# EAGLE design dac (EAGLE 8.3.2)

## Sheet 1 of 7: Power Supply
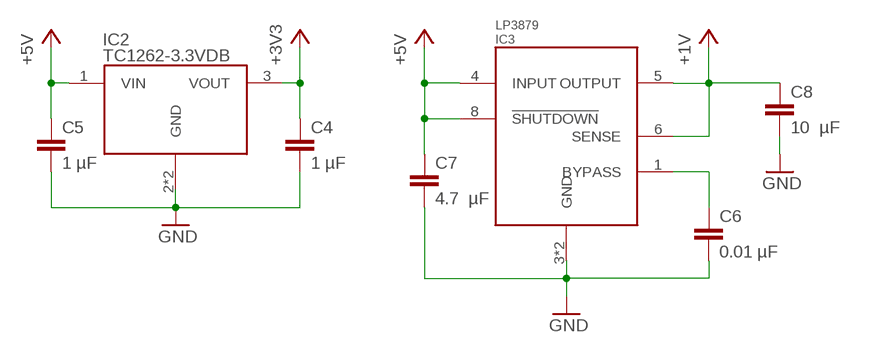
[diagram p0: schematic, sheet 1]

### Parts
C4  1 µF  C-EUC0402  [C0402]
C5  1 µF  C-EUC0402  [C0402]
C6  0.01 µF  C-EUC0402  [C0402]
C7  4.7 µF  C-EUC0402  [C0402]
C8  10 µF  C-EUC0402  [C0402]
IC2  TC1262-3.3VDB  [SOT223]
IC3  LP3879  [SO08]

### Nets
+1V: C8.1 IC3.5(OUTPUT) IC3.6(SENSE) ; also sheet 3,7
+3V3: C4.1 IC2.3(VOUT) ; also sheet 3,4,7
+5V: C5.1 C7.1 IC2.1(VIN) IC3.4(INPUT) IC3.8(!SHUTDOWN) ; also sheet 2,3,4,5,6
GND: C4.2 C5.2 C6.2 C7.2 C8.2 IC2.2(GND) IC2.4(GND) IC3.3(GND) IC3.P$1(GND) ; also sheet 2,3,4,5,6,7
N$2: C6.1 IC3.1(BYPASS)

## Sheet 2 of 7: USB Connection + RESET
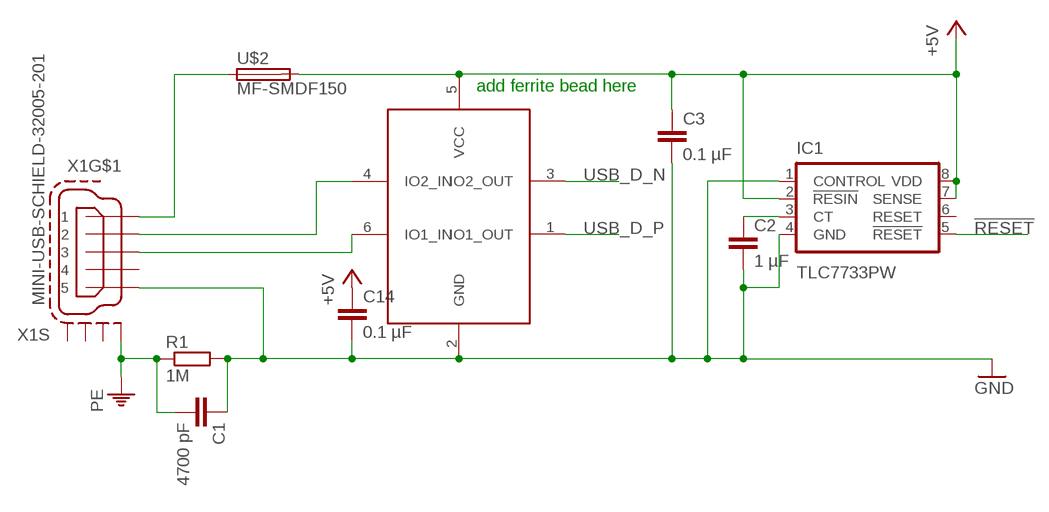
[diagram p1: schematic, sheet 2]

### Parts
C1  4700 pF  C-EUC0402  [C0402]
C2  1 µF  C-EUC0402  [C0402]
C3  0.1 µF  C-EUC0402  [C0402]
C14  0.1 µF  C-EUC0402  [C0402]
IC1  TLC7733PW  [PW_R-PDSO-G08]
IC5  RCLAMP0502ASMD  [SOT666]
R1  1M  R-EU_R0402  [R0402]
U$2  MF-SMDF150  [MF-SMDF050]
X1  MINI-USB-SCHIELD-32005-201  [32005-201]

### Nets
!RESET: IC1.5(!RESET) ; also sheet 3,4,7
+5V: C3.1 C14.1 IC1.2(!RESIN) IC1.7(SENSE) IC1.8(VDD) IC5.5(VCC) U$2.2 ; also sheet 1,3,4,5,6
GND: C1.1 C2.2 C3.2 C14.2 IC1.1(CONTROL) IC1.4(GND) IC5.2(GND) R1.2 X1.5 ; also sheet 1,3,4,5,6,7
N$1: U$2.1 X1.1
N$3: IC5.4(IO2_IN) X1.2
N$4: IC5.6(IO1_IN) X1.3
N$5: C2.1 IC1.3(CT)
PE: C1.2 R1.1 X1.M1(S:S1)
USB_D_N: IC5.3(IO2_OUT) ; also sheet 3
USB_D_P: IC5.1(IO1_OUT) ; also sheet 3
Unconnected: IC1.6(RESET) X1.4 X1.M2(S:S2) X1.M3(S:S3) X1.M4(S:S4)

### Notes on the sheet
- add ferrite bead here

## Sheet 3 of 7: USB to I2S
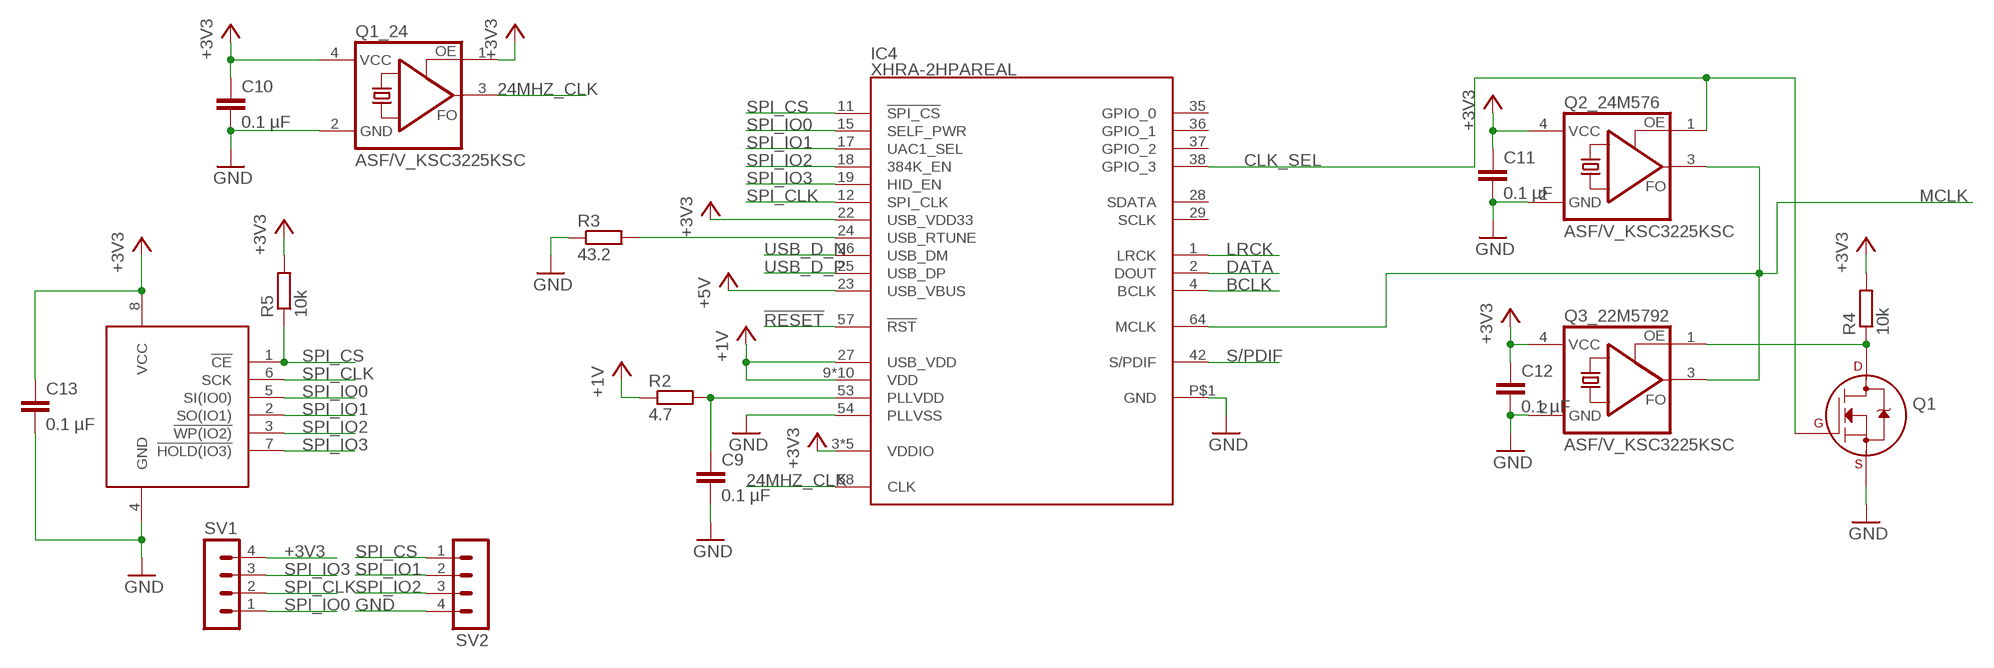
[diagram p2: schematic, sheet 3]

### Parts
C9  0.1 µF  C-EUC0402  [C0402]
C10  0.1 µF  C-EUC0402  [C0402]
C11  0.1 µF  C-EUC0402  [C0402]
C12  0.1 µF  C-EUC0402  [C0402]
C13  0.1 µF  C-EUC0402  [C0402]
IC4  XHRA-2HPAREAL  [TQFP64-10X10]
Q1  2N7002_SOT23  [SOT-23]
Q1_24  ASF/V_KSC3225KSC  [KSC]
Q2_24M576  ASF/V_KSC3225KSC  [KSC]
Q3_22M5792  ASF/V_KSC3225KSC  [KSC]
R2  4.7  R-EU_R0402  [R0402]
R3  43.2  R-EU_R0402  [R0402]
R4  10k  R-EU_R0402  [R0402]
R5  10k  R-EU_R0402  [R0402]
SV1  MA04-1  [MA04-1]
SV2  MA04-1  [MA04-1]
U$1  S25FL116K  [SO8]

### Nets
24MHZ_CLK: IC4.58(CLK) Q1_24.3(FO)
!RESET: IC4.57(!RST) ; also sheet 2,4,7
+1V: IC4.9(VDD) IC4.10(VDD) IC4.20(VDD) IC4.27(USB_VDD) IC4.31(VDD) IC4.39(VDD) IC4.40(VDD) IC4.41(VDD) IC4.52(VDD) IC4.56(VDD) IC4.59(VDD) R2.1 ; also sheet 1,7
+3V3: C10.1 C11.1 C12.1 C13.1 IC4.3(VDDIO) IC4.13(VDDIO) IC4.22(USB_VDD33) IC4.34(VDDIO) IC4.44(VDDIO) IC4.55(VDDIO) Q1_24.1(OE) Q1_24.4(VCC) Q2_24M576.4(VCC) Q3_22M5792.4(VCC) R4.2 R5.2 SV1.4 U$1.8(VCC) ; also sheet 1,4,7
+5V: IC4.23(USB_VBUS) ; also sheet 1,2,4,5,6
BCLK: IC4.4(BCLK) ; also sheet 4
CLK_SEL: IC4.38(GPIO_3) Q1.1(G) Q2_24M576.1(OE)
DATA: IC4.2(DOUT) ; also sheet 4
GND: C9.2 C10.2 C11.2 C12.2 C13.2 IC4.54(PLLVSS) IC4.P$1(GND) Q1.2(S) Q1_24.2(GND) Q2_24M576.2(GND) Q3_22M5792.2(GND) R3.1 SV2.4 U$1.4(GND) ; also sheet 1,2,4,5,6,7
LRCK: IC4.1(LRCK) ; also sheet 4
MCLK: IC4.64(MCLK) Q2_24M576.3(FO) Q3_22M5792.3(FO) ; also sheet 4
N$6: C9.1 IC4.53(PLLVDD) R2.2
N$7: IC4.24(USB_RTUNE) R3.2
N$9: Q1.3(D) Q3_22M5792.1(OE) R4.1
S/PDIF: IC4.42(S/PDIF)
SPI_CLK: IC4.12(SPI_CLK) SV1.2 U$1.6(SCK)
SPI_CS: IC4.11(!SPI_CS) R5.1 SV2.1 U$1.1(!CE)
SPI_IO0: IC4.15(SELF_PWR) SV1.1 U$1.5(SI(IO0))
SPI_IO1: IC4.17(UAC1_SEL) SV2.2 U$1.2(SO(IO1))
SPI_IO2: IC4.18(384K_EN) SV2.3 U$1.3(!WP(IO2))
SPI_IO3: IC4.19(HID_EN) SV1.3 U$1.7(!HOLD(IO3))
USB_D_N: IC4.26(USB_DM) ; also sheet 2
USB_D_P: IC4.25(USB_DP) ; also sheet 2
Unconnected: IC4.28(SDATA) IC4.29(SCLK) IC4.35(GPIO_0) IC4.36(GPIO_1) IC4.37(GPIO_2)

## Sheet 4 of 7: DAC
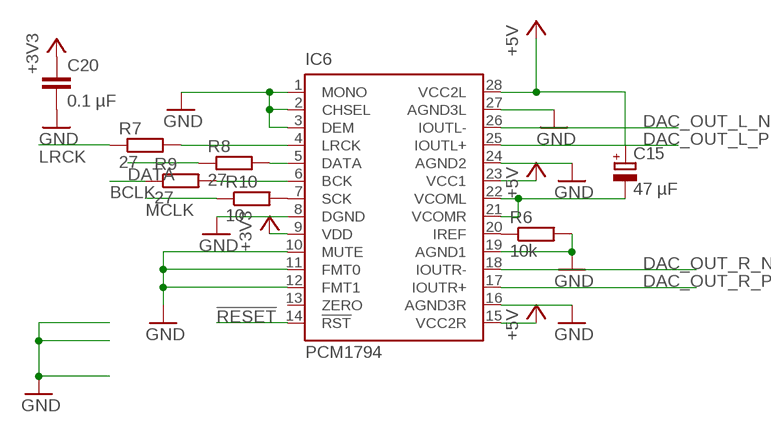
[diagram p3: schematic, sheet 4]

### Parts
C15  47 µF  CPOL-EU140CLH-0810  [140CLH-0810]
C20  0.1 µF  C-EUC0402  [C0402]
IC6  PCM1794  [DB_R-PDSO-G28]
R6  10k  R-EU_R0603  [R0603]
R7  27  R-EU_R0603  [R0603]
R8  27  R-EU_R0603  [R0603]
R9  27  R-EU_R0603  [R0603]
R10  10  R-EU_R0603  [R0603]

### Nets
!RESET: IC6.14(!RST) ; also sheet 2,3,7
+3V3: C20.1 IC6.9(VDD) ; also sheet 1,3,7
+5V: C15.+ IC6.15(VCC2R) IC6.23(VCC1) IC6.28(VCC2L) ; also sheet 1,2,3,5,6
BCLK: R9.1 ; also sheet 3
DAC_OUT_L_N: IC6.26(IOUTL-) ; also sheet 5
DAC_OUT_L_P: IC6.25(IOUTL+) ; also sheet 5
DAC_OUT_R_N: IC6.18(IOUTR-) ; also sheet 5
DAC_OUT_R_P: IC6.17(IOUTR+) ; also sheet 5
GND: C20.2 IC6.1(MONO) IC6.2(CHSEL) IC6.3(DEM) IC6.8(DGND) IC6.10(MUTE) IC6.11(FMT0) IC6.12(FMT1) IC6.16(AGND3R) IC6.19(AGND1) IC6.24(AGND2) IC6.27(AGND3L) R6.2 ; also sheet 1,2,3,5,6,7
N$8: C15.- IC6.21(VCOMR) IC6.22(VCOML)
N$10: IC6.4(LRCK) R7.2
N$15: IC6.20(IREF) R6.1
N$16: IC6.5(DATA) R8.2
N$17: IC6.6(BCK) R9.2
N$18: IC6.7(SCK) R10.2
Unconnected: IC6.13(ZERO) R7.1 R8.1 R10.1

## Sheet 5 of 7: I/V
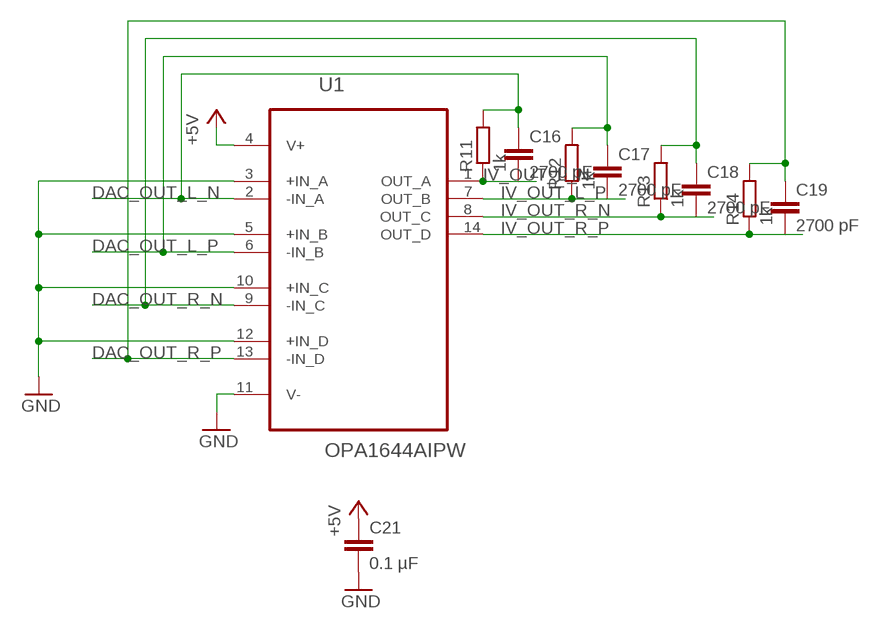
[diagram p4: schematic, sheet 5]

### Parts
C16  2700 pF  C-EUC0603  [C0603]
C17  2700 pF  C-EUC0603  [C0603]
C18  2700 pF  C-EUC0603  [C0603]
C19  2700 pF  C-EUC0603  [C0603]
C21  0.1 µF  C-EUC0603  [C0603]
R11  1k  R-EU_R0603  [R0603]
R12  1k  R-EU_R0603  [R0603]
R13  1k  R-EU_R0603  [R0603]
R14  1k  R-EU_R0603  [R0603]
U1  OPA1644AIPW  [SOP65P640X120-14N]

### Nets
+5V: C21.1 U1.4(V+) ; also sheet 1,2,3,4,6
DAC_OUT_L_N: C16.1 R11.2 U1.2(-IN_A) ; also sheet 4
DAC_OUT_L_P: C17.1 R12.2 U1.6(-IN_B) ; also sheet 4
DAC_OUT_R_N: C18.1 R13.2 U1.9(-IN_C) ; also sheet 4
DAC_OUT_R_P: C19.1 R14.2 U1.13(-IN_D) ; also sheet 4
GND: C21.2 U1.3(+IN_A) U1.5(+IN_B) U1.10(+IN_C) U1.11(V-) U1.12(+IN_D) ; also sheet 1,2,3,4,6,7
IV_OUT_L_N: C16.2 R11.1 U1.1(OUT_A) ; also sheet 6
IV_OUT_L_P: C17.2 R12.1 U1.7(OUT_B) ; also sheet 6
IV_OUT_R_N: C18.2 R13.1 U1.8(OUT_C) ; also sheet 6
IV_OUT_R_P: C19.2 R14.1 U1.14(OUT_D) ; also sheet 6

## Sheet 6 of 7: Output
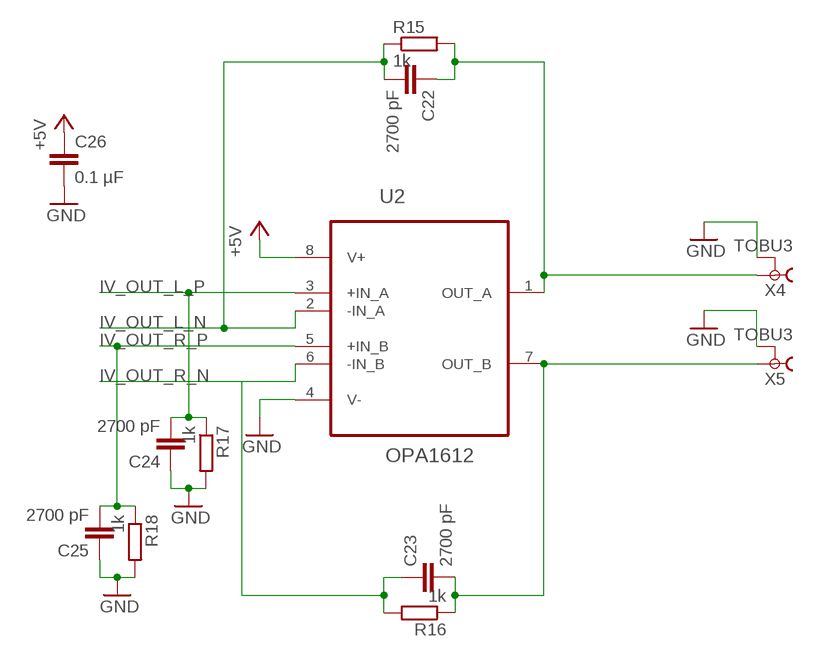
[diagram p5: schematic, sheet 6]

### Parts
C22  2700 pF  C-EUC0603  [C0603]
C23  2700 pF  C-EUC0603  [C0603]
C24  2700 pF  C-EUC0603  [C0603]
C25  2700 pF  C-EUC0603  [C0603]
C26  0.1 µF  C-EUC0603  [C0603]
R15  1k  R-EU_R0603  [R0603]
R16  1k  R-EU_R0603  [R0603]
R17  1k  R-EU_R0603  [R0603]
R18  1k  R-EU_R0603  [R0603]
U2  OPA1612  [SO8]
X4  TOBU3  [TOBU3]
X5  TOBU3  [TOBU3]

### Nets
+5V: C26.1 U2.8(V+) ; also sheet 1,2,3,4,5
GND: C24.1 C25.1 C26.2 R17.2 R18.2 U2.4(V-) X4.2 X4.2@1 X4.2@2 X5.2 X5.2@1 X5.2@2 ; also sheet 1,2,3,4,5,7
IV_OUT_L_N: C22.2 R15.1 U2.2(-IN_A) ; also sheet 5
IV_OUT_L_P: C24.2 R17.1 U2.3(+IN_A) ; also sheet 5
IV_OUT_R_N: C23.1 R16.2 U2.6(-IN_B) ; also sheet 5
IV_OUT_R_P: C25.2 R18.1 U2.5(+IN_B) ; also sheet 5
N$13: C22.1 R15.2 U2.1(OUT_A) X4.1
N$14: C23.2 R16.1 U2.7(OUT_B) X5.1

## Sheet 7 of 7: Reset
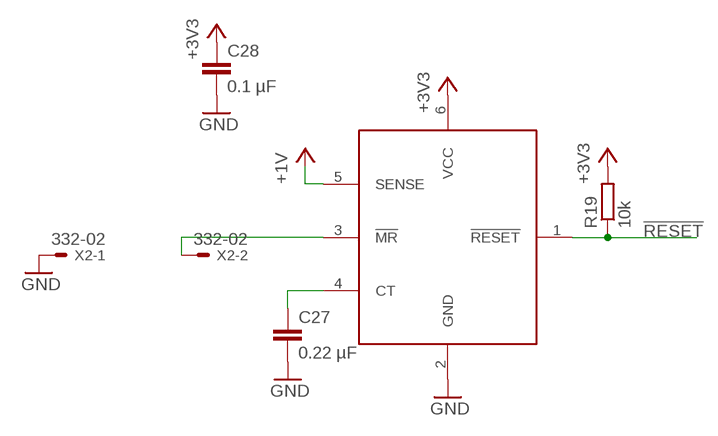
[diagram p6: schematic, sheet 7]

### Parts
C27  0.22 µF  C-EUC0603  [C0603]
C28  0.1 µF  C-EUC0603  [C0603]
R19  10k  R-EU_R0603  [R0603]
U$4  TPS3808  [SOT23-6]
X2  332-02  [332-02]

### Nets
!RESET: R19.1 U$4.1(!RESET) ; also sheet 2,3,4
+1V: U$4.5(SENSE) ; also sheet 1,3
+3V3: C28.1 R19.2 U$4.6(VCC) ; also sheet 1,3,4
GND: C27.2 C28.2 U$4.2(GND) X2.1 ; also sheet 1,2,3,4,5,6
N$11: C27.1 U$4.4(CT)
N$12: U$4.3(!MR) X2.2

## Library data of the parts
C1 = rcl:C-EU: CAPACITOR, European symbol; MF: AVX; MPN: 08055C472KAT2A; OC_FARNELL: 499213
C2 C4-C8 = rcl:C-EU: CAPACITOR, European symbol; MF: MULTICOMP; MPN: MC0805B104K500A5.08MM; OC_FARNELL: 2395773
C3 C10-C14 C20 = rcl:C-EU: CAPACITOR, European symbol; MF: WALSIN; MPN: 0402N101J500CT; OC_FARNELL: 2496792
C9 C16-C19 C21-C26 = rcl:C-EU: CAPACITOR, European symbol
C15 = rcl:CPOL-EU: POLARIZED CAPACITOR, European symbol
C27 C28 = resistor:C-EU: CAPACITOR, European symbol
IC1 = texas:TLC77*: MICROPOWER SUPPLY VOLTAGE SUPERVISORS Source: www.ti.com/.. slvs087l.pdf; MPN: TLC7733QPWG4; OC_FARNELL: unknown; OC_NEWARK: 54K1054
IC2 = jean:TC1262-3.3VDB
IC3 = jean:LP3879
IC4 = jean:XHRA-2HPA
IC5 = jean:RCLAMP0502A; OC_FARNELL: unknown
IC6 = jean:PCM1794: 24-BIT, 192-kHz SAMPLING, ADVANCED SEGMENT, AUDIO STEREO DIGITAL-TO-ANALOG CONVERTER Source: http://focus.ti.com/lit/ds/symlink/pcm1792.pdf; MF: TEXAS INSTRUMENTS; MPN: PCM1792DB; OC_FARNELL: 1207081; OC_NEWARK: 61H5171
Q1 = transistors:2N700*: 2N7000, 2N7002, NDS7002A N-channel enhancement mode MOSFET
Q1_24 Q2_24M576 Q3_22M5792 = jean:ASF/V*_KSC3225: CRYSTAL CLOCK OSCILLATORS 5.0 Vdc or 3.3 Vdc - LOW PROFILE ULTRA MINIATURE CERAMIC SURFACE MOUNT Source: http://www.abracon.com/Oscillators/asf1-L-L1.pdf
R1 = rcl:R-EU_: RESISTOR, European symbol; MF: VISHAY; MPN: CRCW20101M00FKEF; OC_FARNELL: 1470038
R2-R5 R19 = resistor:R-EU_: RESISTOR, European symbol
R6-R18 = rcl:R-EU_: RESISTOR, European symbol
SV1 SV2 = con-lstb:MA04-1: PIN HEADER; OC_FARNELL: unknown; OC_NEWARK: unknown
U1 = OPA1644:OPA1644AIPW: AUDIO OPERATIONAL AMPLIFIERS; MPN: OPA1644AIPW; OC_FARNELL: 1882283; OC_NEWARK: 27T6636; PACKAGE: TSSOP-14; SUPPLIER: Texas Instruments
U2 = OPA1644:OPA1612: AUDIO OPERATIONAL AMPLIFIERS
U$1 = jean:S25FL116K
U$2 = fuse:MF-SMDF: MF-SMDF Series - PRC Resettable Fuses Source: http://www.farnell.com/datasheets/716597.pdf; MF: BOURNS; MPN: MF-SMDF150-2; OC_FARNELL: 2336867
U$4 = jean:TPS3808
X1 = con-cypressindustries:MINI-USB-SCHIELD-: MINI USB-B Conector Source: www.cypressindustries.com; OC_FARNELL: unknown; OC_NEWARK: unknown
X2 = con-garry:332-02: 2 Pin - 2mm Dual Row Source: www.mpe-connector.de / garry_shortform_2012.pdf
X4 X5 = jean:TOBU3: Female Cinch CONNECTOR ( RCA Jack ); MF: FARNELL; MPN: TOBU 3; OC_FARNELL: 592791; OC_NEWARK: 06WX5914

## Board
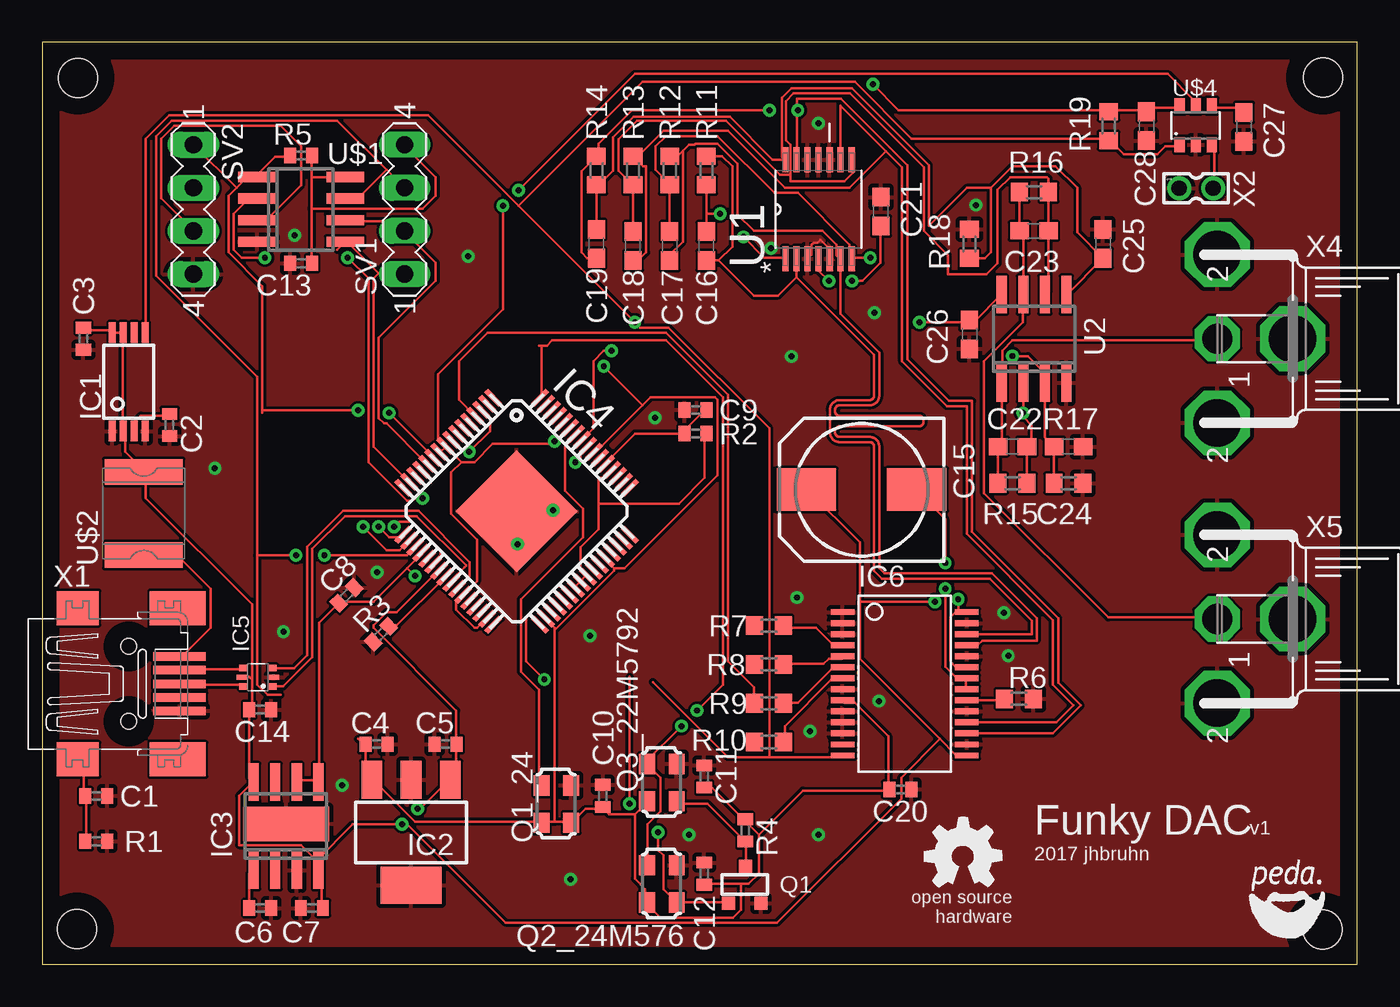
[diagram p7: board, top side]
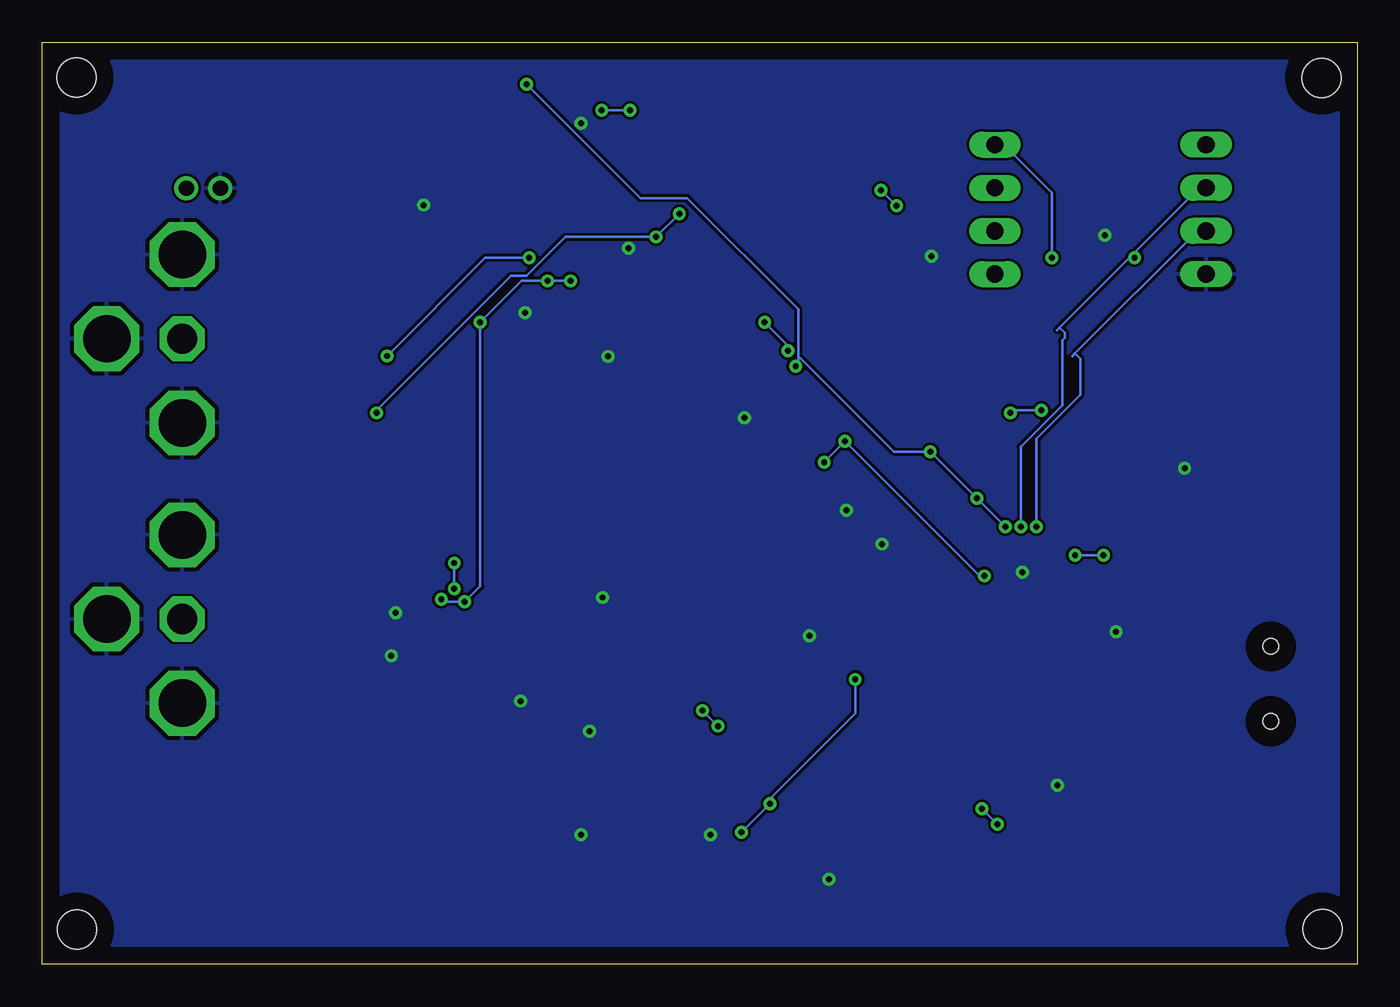
[diagram p8: board, bottom side, seen from below]

Size 77.45 x 54.28 mm. Coordinates in mm from the lower left corner, seen from the top.
Outline: 0,0 77.45,0 77.45,54.28 0,54.28 0,0
Copper layers (1*16): Top 0.035mm / dielectric 1.5mm / Bottom 0.035mm
Design rules "default": minimum track width 6mil, minimum drill 0.35mm, track to track 6mil, track to pad 6mil, pad to pad 6mil, via to via 6mil, smd to smd 6mil, copper to edge 40mil, drill to drill 6mil, minimum pad ring 10mil, minimum via ring 8mil, stop-mask expansion 4mil, vias tented up to drill 0mil, thermal gap 10mil
Holes 2.29 mm at 75.44,52.22 2.08,52.2 2.03,2.06 75.41,2.03

### Footprints (pad centres in the part's own frame; a part is rotated, then mirrored left to right if it is on the bottom)
C0402 = smd 0.7 x 0.9: 1 -0.65,0; 2 0.65,0
140CLH-0810 = smd 3.5 x 2.5: + 3.25,0; - -3.25,0
C0603 = smd 1.1 x 1: 1 -0.85,0; 2 0.85,0
PW_R-PDSO-G08 = smd 0.4 x 1.2: 1 -0.975,-2.9; 2 -0.325,-2.9; 3 0.325,-2.9; 4 0.975,-2.9; 5 0.975,2.9; 6 0.325,2.9; 7 -0.325,2.9; 8 -0.975,2.9
SOT223 = smd 1.219 x 2.235: 1 -2.311,-3.099; 2 0,-3.099; 3 2.311,-3.099 | smd 3.6 x 2.2: 4 0,3.099
SO08 = smd 0.6 x 2.2: 1 -1.905,-2.6; 2 -0.635,-2.6; 3 0.635,-2.6; 4 1.905,-2.6; 5 1.905,2.6; 6 0.635,2.6; 7 -0.635,2.6; 8 -1.905,2.6 | smd 5.08 x 2.032: P$1 0,0.127
TQFP64-10X10 = smd 1.2 x 0.3: 1 -5.7,3.75; 2 -5.7,3.25; 3 -5.7,2.75; 4 -5.7,2.25; 5 -5.7,1.75; 6 -5.7,1.25; 7 -5.7,0.75; 8 -5.7,0.25; 9 -5.7,-0.25; 10 -5.7,-0.75; 11 -5.7,-1.25; 12 -5.7,-1.75; 13 -5.7,-2.25; 14 -5.7,-2.75; 15 -5.7,-3.25; 16 -5.7,-3.75; 33 5.7,-3.75; 34 5.7,-3.25; 35 5.7,-2.75; 36 5.7,-2.25; 37 5.7,-1.75; 38 5.7,-1.25; 39 5.7,-0.75; 40 5.7,-0.25; 41 5.7,0.25; 42 5.7,0.75; 43 5.7,1.25; 44 5.7,1.75; 45 5.7,2.25; 46 5.7,2.75; 47 5.7,3.25; 48 5.7,3.75 | smd 0.3 x 1.2: 17 -3.75,-5.7; 18 -3.25,-5.7; 19 -2.75,-5.7; 20 -2.25,-5.7; 21 -1.75,-5.7; 22 -1.25,-5.7; 23 -0.75,-5.7; 24 -0.25,-5.7; 25 0.25,-5.7; 26 0.75,-5.7; 27 1.25,-5.7; 28 1.75,-5.7; 29 2.25,-5.7; 30 2.75,-5.7; 31 3.25,-5.7; 32 3.75,-5.7; 49 3.75,5.7; 50 3.25,5.7; 51 2.75,5.7; 52 2.25,5.7; 53 1.75,5.7; 54 1.25,5.7; 55 0.75,5.7; 56 0.25,5.7; 57 -0.25,5.7; 58 -0.75,5.7; 59 -1.25,5.7; 60 -1.75,5.7; 61 -2.25,5.7; 62 -2.75,5.7; 63 -3.25,5.7; 64 -3.75,5.7 | smd 5.08 x 5.08: P$1 0,0
SOT666 = smd 0.375 x 0.5: 1 -0.537,-0.85; 3 0.538,-0.85; 4 0.538,0.85; 6 -0.538,0.85 | smd 0.3 x 0.65: 2 0,-0.925; 5 0,0.925
DB_R-PDSO-G28 = smd 0.348 x 1.397: 1 -4.225,-3.656; 2 -3.575,-3.656; 3 -2.925,-3.656; 4 -2.275,-3.656; 5 -1.625,-3.656; 6 -0.975,-3.656; 7 -0.325,-3.656; 8 0.325,-3.656; 9 0.975,-3.656; 10 1.625,-3.656; 11 2.275,-3.656; 12 2.925,-3.656; 13 3.575,-3.656; 14 4.225,-3.656; 15 4.225,3.656; 16 3.575,3.656; 17 2.925,3.656; 18 2.275,3.656; 19 1.625,3.656; 20 0.975,3.656; 21 0.325,3.656; 22 -0.325,3.656; 23 -0.975,3.656; 24 -1.625,3.656; 25 -2.275,3.656; 26 -2.925,3.656; 27 -3.575,3.656; 28 -4.225,3.656
SOT-23 = smd 0.762 x 0.762: 1 -0.979,-1.101; 2 0.94,-1.101; 3 0.025,1.067
KSC = smd 1.194 x 0.94: 1 -2.088,0.476; 2 0.107,0.476; 3 0.107,2.217; 4 -2.088,2.217
R0402 = smd 0.7 x 0.9: 1 -0.65,0; 2 0.65,0
R0603 = smd 1 x 1.1: 1 -0.85,0; 2 0.85,0
MA04-1 = drill 1.016 long: 1 -3.81,0; 2 -1.27,0; 3 1.27,0; 4 3.81,0
SOP65P640X120-14N = smd 1.473 x 0.356: 1 -2.921,1.956; 2 -2.921,1.295; 3 -2.921,0.66; 4 -2.921,0; 5 -2.921,-0.66; 6 -2.921,-1.295; 7 -2.921,-1.956; 8 2.921,-1.956; 9 2.921,-1.295; 10 2.921,-0.66; 11 2.921,0; 12 2.921,0.66; 13 2.921,1.295; 14 2.921,1.956
SO8 = smd 0.6 x 2.2: 1 -1.905,-2.6; 2 -0.635,-2.6; 3 0.635,-2.6; 4 1.905,-2.6; 5 1.905,2.6; 6 0.635,2.6; 7 -0.635,2.6; 8 -1.905,2.6
MF-SMDF050 = smd 1.5 x 4.6: 1 -2.45,0; 2 2.45,0
SOT23-6 = smd 0.6 x 0.9: 1 -0.95,-1.15; 2 0,-1.15; 3 0.95,-1.15; 4 0.95,1.15; 5 0,1.15; 6 -0.95,1.15
32005-201 = smd 3.1 x 0.5: 1 3,1.6; 2 3,0.8; 3 3,0; 4 3,-0.8; 5 3,-1.6 | smd 2.5 x 2: M1 -3,-4.45; M2 -3,4.45 | smd 3.3 x 2: M3 2.9,4.45; M4 2.9,-4.45 | hole 0.9: 0,2.2; 0,-2.2
332-02 = drill 0.9 pad 1.27: 1 0,-1; 2 0,1
TOBU3 = drill 1.778 octagon: 1 0,0.635 | drill 2.794 octagon: 2 4.953,0.635; 2@1 -4.953,0.635; 2@2 0,5.08

### Placement (x,y rotation side)
C1  3.17,9.91 180 top
C2  7.49,31.75 270 top
C3  2.41,36.83 270 top
C4  19.68,12.95 0 top
C5  23.75,12.95 180 top
C6  12.83,3.3 0 top
C7  15.88,3.3 180 top
C8  17.91,21.72 45 top
C9  38.48,32.64 180 top
C10  33.02,9.91 90 top
C11  38.99,11.05 90 top
C12  38.99,5.33 90 top
C13  15.24,41.27 180 top
C14  12.83,14.99 0 top
C15  48.26,27.94 180 top
C16  39.12,42.29 90 top
C17  36.96,42.29 90 top
C18  34.8,42.29 90 top
C19  32.64,42.42 90 top
C20  50.55,10.29 0 top
C21  49.4,44.32 90 top
C22  57.15,30.48 0 top
C23  58.42,43.18 180 top
C24  60.45,30.48 180 top
C25  62.48,42.42 270 top
C26  54.61,37.08 270 top
C27  70.79,49.3 270 top
C28  65.05,49.35 270 top
IC1  5.08,34.29 0 top
IC2  21.72,7.75 180 top
IC3  14.35,8.13 0 top
IC4  27.94,26.67 315 top
IC5  12.7,16.89 90 top
IC6  50.8,16.51 270 top
Q1  41.4,4.7 0 top
Q1_24  31.62,10.41 90 top
Q2_24M576  37.85,5.71 90 top
Q3_22M5792  37.85,11.68 90 top
R1  3.17,7.24 0 top
R2  38.48,31.24 180 top
R3  19.94,19.43 45 top
R4  41.4,7.87 90 top
R5  15.24,47.62 0 top
R6  57.53,15.62 0 top
R7  42.8,19.94 0 top
R8  42.8,17.65 0 top
R9  42.8,15.37 0 top
R10  42.8,13.08 0 top
R11  39.12,46.74 90 top
R12  36.96,46.74 90 top
R13  34.8,46.74 90 top
R14  32.64,46.74 90 top
R15  57.15,28.32 180 top
R16  58.42,45.47 0 top
R17  60.45,28.32 0 top
R18  54.61,42.42 90 top
R19  62.81,49.35 90 top
SV1  21.34,44.45 90 top
SV2  8.89,44.45 270 top
U1  45.72,44.45 90 top
U2  58.42,36.83 0 top
U$1  15.24,44.45 270 top
U$2  5.97,26.54 90 top
U$3  [OSHW_5MM]  54.23,6.35 0 top
U$4  67.94,49.4 0 top
X1  5.08,16.51 0 top
X2  67.97,45.69 270 top
X4  68.58,36.83 270 top
X5  68.58,20.32 270 top

### Tracks (layer width: path | path; a pad name or v marks a point on that pad's centre or on a via)
24MHZ_CLK
  Top 0.152: Q1_24.3 29.26,10.67 29.26,16.15 28.19,17.22 28.19,21.49 31.85,25.15 31.85,26.82 30.79,27.89 30.79,30.48 31.39,31.09 IC4.58
!RESET  (via drill 0.35)
  Top 0.152: 35.97,16.61 40.39,12.19 42.82,12.19 | 42.82,12.19 47.09,12.19 IC6.14 | 28.04,44.65 v34.9,37.8 35.2,37.49 36.88,37.49 42.82,31.55 42.82,12.19 | 28.04,44.65 22.71,49.99 7.47,49.99 6.1,48.62 6.1,37.34 IC1.5 | U$4.1 66.9,48.16 66.14,48.16 65.68,47.7 63.7,47.7 62.94,48.46 R19.1 62.79,48.62 51.21,48.62 47.85,51.97 35.36,51.97 28.04,44.65 | v33.53,36.12 33.07,36.12 32.46,35.51 32.46,31.55 31.85,30.94 IC4.57
  Bottom 0.152: v33.53,36.12 33.53,36.42 v34.9,37.8
+1V  (via drill 0.35)
  Top 0.152: IC3.6 15.09,10.82 16.15,10.82 IC3.5 16.31,10.82 16.31,20.12 C8.1 17.53,21.34 19.51,21.34 21.49,23.32 | R2.1 39.01,31.24 39.01,28.65 37.49,27.13 32.77,27.13 | v28.04,45.57 34.9,52.43 66.29,52.43 67.82,50.9 67.82,50.6 U$4.5 | v27.13,44.65 27.13,38.56 23.32,34.75 23.32,30.94 23.62,30.63 IC4.9 23.77,30.48 | 21.49,23.32 22.25,24.08 IC4.20 | 31.7,22.55 31.39,22.25 IC4.39 | 31.7,22.55 32,22.86 | 31.7,22.55 IC4.40 | 31.7,29.72 31.7,30.18 32,30.48 IC4.56 | 32.77,28.65 31.7,29.72 | 32.77,28.65 33.07,28.65 33.53,29.11 IC4.52 | 32,22.86 31.7,23.16 31.7,24.54 32.77,25.6 32.77,27.13 | 32.77,28.65 32.77,27.13 | 32,22.86 IC4.41 | IC4.31 26.06,20.27 25.6,19.81 25.45,19.81 24.38,20.88 24.38,21.34 24.69,21.64 IC4.27 24.84,21.79 25.6,22.55 25.6,24.99 24.08,26.52 24.08,28.96 24.69,29.57 | 23.77,30.48 23.47,30.18 IC4.10 | 24.69,29.57 25.45,29.57 26.52,30.63 30.02,30.63 v30.18,30.79 30.94,31.55 IC4.59 | 23.77,30.48 24.69,29.57 | 31.7,29.72 31.55,29.72 v31.39,29.57 | v21.95,22.86 21.49,23.32
  Bottom 0.152: v27.13,44.65 v28.04,45.57 | v31.39,29.57 v30.18,30.79 22.25,22.86 v21.95,22.86
+3V3  (via drill 0.35)
  Top 0.152: 15.85,46.33 15.85,47.55 R5.2 | 15.85,46.33 15.85,44.5 | 15.85,44.5 15.85,41.3 C13.1 | 15.85,46.33 17.83,46.33 U$1.8 | 15.85,44.5 22.4,44.5 23.16,45.26 23.16,46.33 21.34,48.16 SV1.4 | 18.59,13.26 18.9,12.95 C4.1 19.05,11.28 19.36,10.97 IC2.3 19.51,10.82 21.95,8.38 29.26,8.38 Q1_24.4 29.41,8.38 30.18,8.38 | IC6.9 47.24,15.39 47.85,15.39 49.84,13.41 49.84,10.36 C20.1 49.84,10.21 44.81,10.21 42.22,7.62 | 41.15,4.72 41.6,4.72 42.22,5.33 42.22,7.62 | 41.15,4.72 39.01,4.72 C12.1 | 42.22,7.62 41.45,8.38 R4.2 41.3,8.53 39.47,10.36 39.01,10.36 C11.1 | 34.9,8.84 34.9,5.03 35.51,4.42 35.51,3.66 Q2_24M576.4 35.66,3.5 36.42,2.74 40.69,2.74 41.15,3.2 41.15,4.72 | 34.9,8.84 35.51,9.45 Q3_22M5792.4 | 30.18,8.38 31.09,8.38 Q1_24.1 31.24,8.38 32,9.14 32.92,9.14 C10.1 33.07,9.14 33.38,8.84 34.9,8.84 | 30.18,8.38 30.18,19.66 | U$4.6 66.9,50.44 65.23,50.44 65.08,50.29 C28.1 64.92,50.29 62.94,50.29 R19.2 62.79,50.29 50.44,50.29 v48.92,51.82 | v20.73,25.76 21.03,26.06 21.79,26.06 23.47,24.38 23.47,23.93 23.16,23.62 IC4.22 | IC4.13 22.4,29.11 22.86,28.65 22.86,28.35 22.4,27.89 v22.4,27.43 21.95,27.43 21.79,27.28 21.49,27.28 19.2,29.57 19.2,40.39 v17.98,41.6 | v25.15,30.18 26.36,31.39 26.36,32.16 25.91,32.61 IC4.3 | 35.36,32.92 35.81,33.38 39.62,33.38 39.78,33.22 39.78,28.8 34.29,23.32 33.68,23.32 | 35.36,32.92 32.61,30.18 IC4.55 | 30.18,19.66 30.18,19.81 29.72,20.27 IC4.34 | 33.68,23.32 33.22,23.77 IC4.44 | 33.68,23.32 33.68,23.16 30.18,19.66 | v33.07,35.2 35.36,32.92
  Bottom 0.152: SV1.4 21.34,48.16 20.73,48.16 17.98,45.41 v17.98,41.6 17.98,41.3 | v48.92,51.82 42.22,45.11 39.47,45.11 32.92,38.56 32.92,35.81 | 32.92,35.81 32.92,35.2 v33.07,35.2 | v20.73,25.76 v22.4,27.43 v25.15,30.18 27.28,30.18 32.92,35.81
+5V  (via drill 0.35)
  Top 0.152: U2.8 56.39,39.32 55.02,37.95 54.71,37.95 C26.1 54.56,37.8 v51.66,37.8 | v47.7,40.23 48.31,40.23 49.38,41.3 49.38,43.43 C21.1 | v46.33,40.23 45.72,40.84 U1.4 | 53.95,20.73 54.41,20.73 IC6.28 53.95,20.73 | 53.95,20.73 53.8,20.73 53.49,20.42 53.49,17.83 53.8,17.53 54.41,17.53 IC6.23 | 52.88,13.26 48.16,17.98 48.16,21.34 | 52.88,13.26 53.8,12.34 54.41,12.34 IC6.15 | 48.16,21.34 48.16,24.84 45.11,27.89 C15.+ | v53.95,21.49 53.95,20.73 | 48.16,21.34 v52.58,21.34 | C3.1 2.44,37.34 3.96,37.34 IC1.8 4.72,37.19 | 4.72,37.19 4.72,31.39 IC1.2 4.88,31.24 4.88,30.18 5.94,29.11 U$2.2 6.1,28.96 6.1,27.43 12.34,21.18 12.34,16.76 | 4.72,37.19 IC1.7 | 24.38,12.95 24.38,11.28 24.08,10.97 IC2.1 23.93,10.82 22.25,9.14 v22.1,9.14 | 24.38,12.95 24.38,14.94 19.51,19.81 19.51,19.96 20.27,20.73 20.88,20.73 23.32,23.16 IC4.23 | 24.38,12.95 C5.1 | C7.1 16.46,3.35 16.46,5.33 16.31,5.49 IC3.4 | 12.34,16.76 12.19,16.92 11.89,16.92 IC5.5 | 12.34,16.76 12.34,15.24 12.19,15.09 C14.1 12.19,14.94 12.19,10.97 12.34,10.82 IC3.8 12.34,10.67 11.58,9.91 11.58,7.01 15.24,7.01 16.15,6.1 | 16.15,6.1 16.15,5.64 IC3.4 | 16.15,6.1 18.29,8.23 v21.18,8.23 21.49,8.23 27.28,2.44 43.28,2.44 50.6,9.75 50.6,10.97 52.88,13.26 | 16.15,6.1 IC3.4
  Bottom 0.152: v46.33,40.23 v47.7,40.23 49.23,40.23 v51.66,37.8 51.66,22.25 v52.58,21.34 53.8,21.34 v53.95,21.49 | v21.18,8.23 v22.1,9.14
BCLK
  Top 0.152: R9.1 41.91,15.39 41.91,16.31 40.39,17.83 40.39,33.53 36.73,37.19 26.21,37.19 24.54,35.51 24.54,33.22 25.45,32.31 IC4.4
CLK_SEL  (via drill 0.35)
  Top 0.152: Q1.1 40.39,3.66 37.49,3.66 Q2_24M576.1 37.34,3.66 36.58,4.42 36.58,6.4 36.27,6.71 v36.27,7.77 | v34.59,9.45 34.59,16.92 | v29.57,16.76 28.5,17.83 28.5,20.42 30.33,22.25 30.48,22.25 30.94,21.79 IC4.38
  Bottom 0.152: v36.27,7.77 v34.59,9.45 34.59,9.75 29.57,14.78 v29.57,16.76
DAC_OUT_L_N
  Top 0.152: 44.42,40.45 U1.2 | 44.42,40.45 49,35.88 49,33.48 arc-90 48.73,33.22 46.96,33.22 arc90 46.39,32.65 46.39,31.32 arc90 46.96,30.75 48.73,30.75 arc-90 49,30.48 49,23.18 49.47,22.71 55.82,22.71 58.29,20.23 58.29,19.43 IC6.26 | 39.84,41.44 C16.1 | 44.42,40.45 43.34,39.37 41.91,39.37 39.84,41.44 | R11.2 40.04,47.59 40.64,46.99 40.64,42.24 39.84,41.44
DAC_OUT_L_P
  Top 0.152: IC6.25 55.12,18.8 55.37,19.05 58.57,19.05 58.57,20.38 55.94,23.01 49.59,23.01 49.3,23.3 49.3,30.48 arc90 48.73,31.05 46.96,31.05 arc-90 46.7,31.32 46.7,31.41 arc-90 46.96,31.67 51.64,31.67 arc90 51.91,31.94 51.91,32.02 arc90 51.64,32.29 46.96,32.29 arc-90 46.7,32.56 46.7,32.65 arc-90 46.96,32.91 48.73,32.91 arc90 49.3,33.48 49.3,36 47.02,38.29 U1.6 46.79,41.76 46.79,42.36 45.97,43.18 41.91,43.18 40.95,44.15 40.95,47.13 39.76,48.31 38.47,48.31 38.42,48.26 38.1,48.26 37.74,47.9 | C17.1 36.96,41.77 37.74,42.55 37.74,47.9 | R12.2 37.43,47.59 37.74,47.9
DAC_OUT_R_N
  Top 0.152: IC6.18 59.74,14.23 60.74,15.24 59.54,16.45 59.54,20.26 54.46,25.34 54.46,32.87 53.28,32.87 50.65,35.5 50.65,46.93 49.7,47.87 | 49.7,47.87 47.02,50.56 | U1.9 47.02,50.56 | 47.02,50.56 47.01,50.56 | C18.1 35.09,41.44 35.56,41.91 35.56,46.99 35.39,46.99 R13.2 34.9,47.7 35.2,47.7 36.58,49.07 40.39,49.07 43.74,45.72 47.55,45.72 49.7,47.87
DAC_OUT_R_P  (via drill 0.35)
  Top 0.152: IC6.17 59.52,13.59 61.18,15.24 59.84,16.57 59.84,20.38 54.76,25.46 54.76,33.17 53.4,33.17 50.95,35.62 50.95,47.05 47.05,50.95 44.45,50.95 44.45,50.29 | 44.45,50.29 44.45,47.4 U1.13 | C19.1 32.09,41.57 31.75,41.91 31.75,46.7 R14.2 32.77,47.7 32.77,48.31 34.75,50.29 v42.82,50.29 | v44.5,50.29 44.45,50.29
  Bottom 0.152: v44.5,50.29 v42.82,50.29
GND  (via drill 0.35)
  Top 0.152: R18.2 54.56,43.28 54.53,43.34 | U1.5 46.38,42.14 45.85,42.67 45.67,42.49 45.45,42.49 45.31,42.36 45.31,41.78 U1.3 | v27.99,24.74 27.94,24.79 IC4.P$1
  other vias: 45.72,49.53 49.02,38.35 54.99,44.7 42.93,42.16 56.64,20.7 56.9,18.16 45.21,13.72 44.45,21.59 49.28,15.49 38.1,7.62 45.72,7.62 17.65,10.54 14.86,42.93 10.16,29.21 25.07,41.68 44.12,35.79 31.11,5 30.07,26.72 36.09,32.18 19.71,23.09 14.2,19.58 32.26,19.33
  pour Top: 0,0 77.7,-0.28 77.7,54.33 0,54.61
  pour Bottom: 0,54.61 0,0 77.52,-0.3 77.52,54.31
IV_OUT_L_N  (via drill 0.35)
  Top 0.152: C16.2 39.12,44.2 | 39.12,44.2 39.12,45.47 39.37,45.72 39.28,45.72 R11.1 | R15.1 C22.2 58.42,30.48 58.27,30.63 58.27,31.75 57.78,32.23 57.78,32.46 | U2.2 57.78,32.46 | v41.3,42.82 42.52,41.6 43.74,41.6 U1.1 | 39.12,44.2 v39.93,44.2 | v57.76,32.46 57.78,32.46
  Bottom 0.152: v39.93,44.2 v41.3,42.82 46.63,42.82 48.92,40.54 49.84,40.54 57.76,32.61 v57.76,32.46
IV_OUT_L_P  (via drill 0.35)
  Top 0.152: C17.2 36.92,43.18 36.83,43.18 36.96,43.31 R12.1 36.88,46.02 36.12,46.79 36.12,48.16 36.73,48.77 39.78,48.77 43.13,45.41 44.5,45.41 47.55,42.37 47.55,41.6 U1.7 47.7,41.6 v48.77,41.6 | U2.3 59.05,32.23 | U2.3 59.05,31.03 C24.2 R17.1 | v57.15,35.81 58.06,35.81 58.98,34.9 58.98,34.29 U2.3
  Bottom 0.152: v57.15,35.81 51.36,41.6 v48.77,41.6
IV_OUT_R_N
  Top 0.152: U2.6 59.27,39.65 C23.1 59.27,45.3 59.69,45.72 59.52,45.72 R16.2 59.27,46.27 59.18,46.35 57.02,46.35 56.26,45.59 56.26,41.27 55.63,40.64 53.34,40.64 53.34,41.76 51.92,43.18 51.92,46.93 47.56,51.28 44.26,51.28 43.8,50.82 43.8,48.53 44.07,48.26 44.07,46.48 | 44.07,46.48 44.07,46.1 47.24,46.1 47.75,46.61 47.75,47.3 U1.8 | C18.2 R13.1 34.78,45.89 33.93,46.74 33.93,48.58 35.03,49.68 40.28,49.68 43.45,46.5 44.05,46.5 44.07,46.48
IV_OUT_R_P
  Top 0.152: U2.5 60.35,39.43 C25.2 60.96,43.09 60.96,45.72 59.69,46.99 57.15,46.99 55.88,45.72 | R18.1 55.54,41.57 55.88,41.91 55.88,45.72 | 55.88,45.72 54.46,45.72 52.22,43.48 52.22,47.05 47.69,51.59 44.13,51.59 43.58,51.03 43.58,47.55 U1.14 | C19.2 R14.1 32.78,45.89 33.63,46.74 33.63,48.7 34.82,49.89 40.49,49.89 | U1.14 43.76,46.81 U1.14 | U1.14 43.02,47.37 40.49,49.89 | 40.49,49.89
MCLK  (via drill 0.35)
  Top 0.152: Q2_24M576.3 35.66,5.94 35.66,8.23 36.42,8.99 36.42,10.97 35.66,11.73 Q3_22M5792.3 35.51,11.89 v37.64,14.02 | 29.41,36.42 29.72,36.42 30.02,36.73 36.73,36.73 40.08,33.38 40.08,16.46 v38.56,14.94 | 29.41,36.42 29.26,36.42 | 29.41,36.42 29.41,33.38 IC4.64
  Bottom 0.152: v37.64,14.02 v38.56,14.94
N$1
  Top 0.152: X1.1 8.23,18.14 9.91,19.81 9.91,22.1 7.92,24.08 6.1,24.08 U$2.1
N$2
  Top 0.152: C6.1 12.19,3.35 12.19,5.33 12.34,5.49 IC3.1
N$3
  Top 0.152: IC5.4 11.73,17.37 8.23,17.37 X1.2
N$4
  Top 0.152: IC5.6 11.73,16.46 8.23,16.46 X1.3
N$5
  Top 0.152: C2.1 7.47,32.31 5.79,32.31 5.49,32 5.49,31.39 IC1.3
N$6
  Top 0.152: C9.1 39.01,32.61 37.95,31.55 37.95,31.24 R2.2 34.9,31.24 33.22,29.57 IC4.53
N$7
  Top 0.152: R3.2 20.42,19.96 20.88,19.96 23.62,22.71 IC4.24
N$8  (via drill 0.35)
  Top 0.152: IC6.21 54.41,16.31 54.41,16.76 IC6.22 54.41,16.92 53.8,16.92 53.19,17.53 v53.19,22.1 | v53.19,23.62 53.19,26.21 51.51,27.89 C15.-
  Bottom 0.152: v53.19,23.62 v53.19,22.1
N$9
  Top 0.152: Q1.3 41.45,5.79 41.45,7.16 R4.1 41.3,7.32 39.17,9.45 37.49,9.45 Q3_22M5792.1
N$10
  Top 0.152: R7.2 43.74,19.81 45.57,19.81 46.48,18.9 47.09,18.9 IC6.4
N$11
  Top 0.152: U$4.4 69.04,50.44 70.56,50.44 70.71,50.29 C27.1
N$12
  Top 0.152: U$4.3 69.04,48.16 69.04,45.72 X2.2
N$13
  Top 0.152: R15.2 C22.1 56.52,30.7 U2.1 56.54,34.29 56.54,36.12 57.15,36.73 69.19,36.73 X4.1
N$14
  Top 0.152: R16.1 C23.2 57.78,42.97 U2.7 57.76,39.32 57.76,37.8 55.47,35.51 55.47,27.74 62.79,20.42 69.19,20.42 X5.1
N$15
  Top 0.152: R6.1 56.54,15.54 54.56,15.54 IC6.20
N$16
  Top 0.152: R8.2 43.74,17.68 46.02,17.68 46.33,17.98 47.09,17.98 IC6.5
N$17
  Top 0.152: R9.2 43.74,15.39 44.5,15.39 46.48,17.37 47.09,17.37 IC6.6
N$18
  Top 0.152: R10.2 43.74,13.11 43.74,14.02 46.48,16.76 47.09,16.76 IC6.7
PE
  Top 0.152: R1.1 2.59,7.32 2.59,9.91 C1.2 2.44,9.91 2.44,11.73 2.13,12.04 X1.M1
SPI_CLK
  Top 0.152: U$1.6 17.98,43.74 20.88,43.74 21.34,43.28 SV1.2 21.34,43.13 23.16,41.3 23.16,40.23 19.81,36.88 19.81,32.16 20.12,31.85 20.27,31.85 22.55,29.57 IC4.12
SPI_CS  (via drill 0.35)
  Top 0.152: R5.1 14.48,47.55 13.72,47.55 12.65,46.48 U$1.1 12.5,46.33 12.04,46.33 11.43,45.72 | 12.95,32.61 12.95,39.93 10.97,41.91 10.97,45.26 11.43,45.72 | 12.95,32.61 12.95,32.46 | 11.43,45.72 SV2.1 | v20.42,32.46 23.01,29.87 IC4.11 | 12.95,32.61 v18.59,32.61
  Bottom 0.152: v20.42,32.46 20.27,32.61 v18.59,32.61
SPI_IO0
  Top 0.152: 17.37,42.06 17.83,42.52 U$1.5 17.98,42.52 19.81,40.69 | 19.81,40.69 21.34,40.69 SV1.1 | 19.81,40.69 19.51,40.39 19.51,30.48 21.49,28.5 IC4.15
SPI_IO1  (via drill 0.35)
  Top 0.152: v13.11,41.6 11.73,41.6 11.28,42.06 11.28,44.2 12.04,44.96 12.5,44.96 U$1.2 | v19.81,25.76 20.42,25.15 21.18,25.15 IC4.17
  Bottom 0.152: 13.26,41.76 9.3,45.72 SV2.2 | 13.26,41.76 17.53,37.49 | 17.53,37.49 17.68,37.34 | 13.26,41.76 v13.11,41.6 | v19.81,25.76 19.81,30.48 17.37,32.92 17.37,36.73 17.22,36.88 17.22,37.19 17.53,37.49
SPI_IO2  (via drill 0.35)
  Top 0.152: U$1.3 12.65,43.89 13.26,43.89 15.24,45.87 15.24,48.16 14.02,49.38 7.77,49.38 7.01,48.62 7.01,45.11 8.84,43.28 SV2.3 | v18.9,25.76 20.27,24.38 21.03,24.38 21.49,24.84 IC4.18
  Bottom 0.152: 16.61,35.97 9.45,43.13 8.99,43.13 SV2.3 | 16.61,35.97 16.76,35.81 | v18.9,25.76 18.9,30.94 16.31,33.53 16.31,35.66 16.61,35.97
SPI_IO3  (via drill 0.35)
  Top 0.152: 14.02,15.85 13.26,15.85 12.65,16.46 12.65,24.08 | 12.65,24.08 12.65,34.59 6.71,40.54 6.71,48.77 7.62,49.68 17.37,49.68 20.27,46.79 | SV1.3 20.27,46.79 | 20.27,46.79 18.59,45.11 17.98,45.11 U$1.7 | v16.61,24.08 21.49,24.08 21.95,24.54 IC4.19 | 12.65,24.08 v14.94,24.08
  Bottom 0.152: v14.94,24.08 v16.61,24.08
USB_D_N
  Top 0.152: IC5.3 14.83,17.43 15.6,18.2 15.6,24.57 17.72,26.7 22.16,26.7 25.18,23.68 25.18,22.85 IC4.26
USB_D_P
  Top 0.152: IC5.1 14.18,16.35 15.9,18.07 15.9,24.45 17.84,26.39 22.04,26.39 24.95,23.48 | 24.95,23.48 24.96,23.46 | IC4.25 24.09,22.59 24.37,22.87 24.87,23.37 24.95,23.45 24.95,23.48

### Text on the board
tNames: Funky DAC | v1 | 2017 jhbruhn